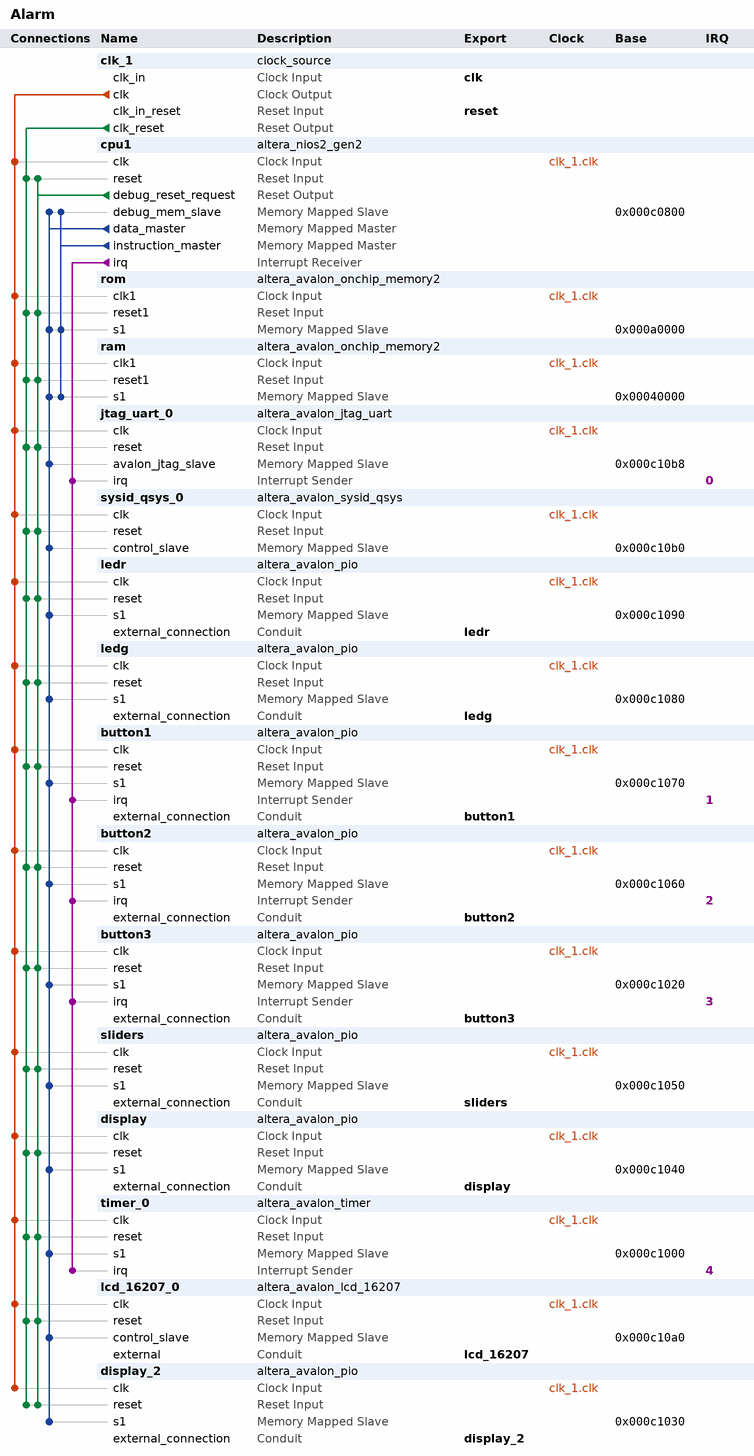
[diagram p0: system contents]
# Platform Designer (Qsys) system Alarm, Cyclone IV E EP4CE115F29C7
# Parameters at their usual value, and those the tool derives, are not listed.
package require -exact qsys 18.1
create_system Alarm
set_project_property DEVICE_FAMILY {Cyclone IV E}
set_project_property DEVICE EP4CE115F29C7

add_instance clk_1 clock_source 18.1
set_instance_parameter_value clk_1 clockFrequency 100000000

add_instance cpu1 altera_nios2_gen2 18.1
set_instance_parameter_value cpu1 dcache_size 2048
set_instance_parameter_value cpu1 exceptionSlave ram.s1
set_instance_parameter_value cpu1 icache_size 4096
set_instance_parameter_value cpu1 impl Tiny
set_instance_parameter_value cpu1 resetSlave rom.s1

add_instance rom altera_avalon_onchip_memory2 18.1
set_instance_parameter_value rom dataWidth 32
set_instance_parameter_value rom dualPort false
set_instance_parameter_value rom initMemContent true
set_instance_parameter_value rom initializationFileName onchip_mem.hex
set_instance_parameter_value rom memorySize 102400
set_instance_parameter_value rom writable false

add_instance ram altera_avalon_onchip_memory2 18.1
set_instance_parameter_value ram dataWidth 32
set_instance_parameter_value ram dualPort false
set_instance_parameter_value ram initMemContent true
set_instance_parameter_value ram initializationFileName onchip_mem.hex
set_instance_parameter_value ram memorySize 204800

add_instance jtag_uart_0 altera_avalon_jtag_uart 18.1
set_instance_parameter_value jtag_uart_0 simInteractiveOptions NO_INTERACTIVE_WINDOWS

add_instance sysid_qsys_0 altera_avalon_sysid_qsys 18.1
set_instance_parameter_value sysid_qsys_0 id 0

add_instance ledr altera_avalon_pio 18.1
set_instance_parameter_value ledr direction Output
set_instance_parameter_value ledr width 2

add_instance ledg altera_avalon_pio 18.1
set_instance_parameter_value ledg direction Output
set_instance_parameter_value ledg width 1

add_instance button1 altera_avalon_pio 18.1
set_instance_parameter_value button1 bitClearingEdgeCapReg true
set_instance_parameter_value button1 captureEdge true
set_instance_parameter_value button1 direction Input
set_instance_parameter_value button1 generateIRQ true
set_instance_parameter_value button1 irqType EDGE
set_instance_parameter_value button1 width 1

add_instance button2 altera_avalon_pio 18.1
set_instance_parameter_value button2 bitClearingEdgeCapReg true
set_instance_parameter_value button2 captureEdge true
set_instance_parameter_value button2 direction Input
set_instance_parameter_value button2 generateIRQ true
set_instance_parameter_value button2 irqType EDGE
set_instance_parameter_value button2 width 1

add_instance button3 altera_avalon_pio 18.1
set_instance_parameter_value button3 bitClearingEdgeCapReg true
set_instance_parameter_value button3 captureEdge true
set_instance_parameter_value button3 direction Input
set_instance_parameter_value button3 generateIRQ true
set_instance_parameter_value button3 irqType EDGE
set_instance_parameter_value button3 width 1

add_instance sliders altera_avalon_pio 18.1
set_instance_parameter_value sliders direction Input
set_instance_parameter_value sliders width 4

add_instance display altera_avalon_pio 18.1
set_instance_parameter_value display direction Output
set_instance_parameter_value display width 32

add_instance timer_0 altera_avalon_timer 18.1
set_instance_parameter_value timer_0 period 1
set_instance_parameter_value timer_0 periodUnits MSEC

add_instance lcd_16207_0 altera_avalon_lcd_16207 18.1

add_instance display_2 altera_avalon_pio 18.1
set_instance_parameter_value display_2 direction Output
set_instance_parameter_value display_2 width 16

# connections
add_connection clk_1.clk button1.clk clock
add_connection clk_1.clk button2.clk clock
add_connection clk_1.clk button3.clk clock
add_connection clk_1.clk cpu1.clk clock
add_connection clk_1.clk display.clk clock
add_connection clk_1.clk display_2.clk clock
add_connection clk_1.clk jtag_uart_0.clk clock
add_connection clk_1.clk lcd_16207_0.clk clock
add_connection clk_1.clk ledg.clk clock
add_connection clk_1.clk ledr.clk clock
add_connection clk_1.clk ram.clk1 clock
add_connection clk_1.clk rom.clk1 clock
add_connection clk_1.clk sliders.clk clock
add_connection clk_1.clk sysid_qsys_0.clk clock
add_connection clk_1.clk timer_0.clk clock
add_connection clk_1.clk_reset button1.reset reset
add_connection clk_1.clk_reset button2.reset reset
add_connection clk_1.clk_reset button3.reset reset
add_connection clk_1.clk_reset cpu1.reset reset
add_connection clk_1.clk_reset display.reset reset
add_connection clk_1.clk_reset display_2.reset reset
add_connection clk_1.clk_reset jtag_uart_0.reset reset
add_connection clk_1.clk_reset lcd_16207_0.reset reset
add_connection clk_1.clk_reset ledg.reset reset
add_connection clk_1.clk_reset ledr.reset reset
add_connection clk_1.clk_reset ram.reset1 reset
add_connection clk_1.clk_reset rom.reset1 reset
add_connection clk_1.clk_reset sliders.reset reset
add_connection clk_1.clk_reset sysid_qsys_0.reset reset
add_connection clk_1.clk_reset timer_0.reset reset
add_connection cpu1.debug_reset_request button1.reset reset
add_connection cpu1.debug_reset_request button2.reset reset
add_connection cpu1.debug_reset_request button3.reset reset
add_connection cpu1.debug_reset_request cpu1.reset reset
add_connection cpu1.debug_reset_request display.reset reset
add_connection cpu1.debug_reset_request display_2.reset reset
add_connection cpu1.debug_reset_request jtag_uart_0.reset reset
add_connection cpu1.debug_reset_request lcd_16207_0.reset reset
add_connection cpu1.debug_reset_request ledg.reset reset
add_connection cpu1.debug_reset_request ledr.reset reset
add_connection cpu1.debug_reset_request ram.reset1 reset
add_connection cpu1.debug_reset_request rom.reset1 reset
add_connection cpu1.debug_reset_request sliders.reset reset
add_connection cpu1.debug_reset_request sysid_qsys_0.reset reset
add_connection cpu1.debug_reset_request timer_0.reset reset
add_connection cpu1.data_master button1.s1 avalon
set_connection_parameter_value cpu1.data_master/button1.s1 baseAddress 0x000c1070
add_connection cpu1.data_master button2.s1 avalon
set_connection_parameter_value cpu1.data_master/button2.s1 baseAddress 0x000c1060
add_connection cpu1.data_master button3.s1 avalon
set_connection_parameter_value cpu1.data_master/button3.s1 baseAddress 0x000c1020
add_connection cpu1.data_master cpu1.debug_mem_slave avalon
set_connection_parameter_value cpu1.data_master/cpu1.debug_mem_slave baseAddress 0x000c0800
add_connection cpu1.data_master display.s1 avalon
set_connection_parameter_value cpu1.data_master/display.s1 baseAddress 0x000c1040
add_connection cpu1.data_master display_2.s1 avalon
set_connection_parameter_value cpu1.data_master/display_2.s1 baseAddress 0x000c1030
add_connection cpu1.data_master jtag_uart_0.avalon_jtag_slave avalon
set_connection_parameter_value cpu1.data_master/jtag_uart_0.avalon_jtag_slave baseAddress 0x000c10b8
add_connection cpu1.data_master lcd_16207_0.control_slave avalon
set_connection_parameter_value cpu1.data_master/lcd_16207_0.control_slave baseAddress 0x000c10a0
add_connection cpu1.data_master ledg.s1 avalon
set_connection_parameter_value cpu1.data_master/ledg.s1 baseAddress 0x000c1080
add_connection cpu1.data_master ledr.s1 avalon
set_connection_parameter_value cpu1.data_master/ledr.s1 baseAddress 0x000c1090
add_connection cpu1.data_master ram.s1 avalon
set_connection_parameter_value cpu1.data_master/ram.s1 baseAddress 0x00040000
add_connection cpu1.data_master rom.s1 avalon
set_connection_parameter_value cpu1.data_master/rom.s1 baseAddress 0x000a0000
add_connection cpu1.data_master sliders.s1 avalon
set_connection_parameter_value cpu1.data_master/sliders.s1 baseAddress 0x000c1050
add_connection cpu1.data_master sysid_qsys_0.control_slave avalon
set_connection_parameter_value cpu1.data_master/sysid_qsys_0.control_slave baseAddress 0x000c10b0
add_connection cpu1.data_master timer_0.s1 avalon
set_connection_parameter_value cpu1.data_master/timer_0.s1 baseAddress 0x000c1000
add_connection cpu1.instruction_master cpu1.debug_mem_slave avalon
set_connection_parameter_value cpu1.instruction_master/cpu1.debug_mem_slave baseAddress 0x000c0800
add_connection cpu1.instruction_master ram.s1 avalon
set_connection_parameter_value cpu1.instruction_master/ram.s1 baseAddress 0x00040000
add_connection cpu1.instruction_master rom.s1 avalon
set_connection_parameter_value cpu1.instruction_master/rom.s1 baseAddress 0x000a0000
add_connection cpu1.irq button1.irq interrupt
set_connection_parameter_value cpu1.irq/button1.irq irqNumber 1
add_connection cpu1.irq button2.irq interrupt
set_connection_parameter_value cpu1.irq/button2.irq irqNumber 2
add_connection cpu1.irq button3.irq interrupt
set_connection_parameter_value cpu1.irq/button3.irq irqNumber 3
add_connection cpu1.irq jtag_uart_0.irq interrupt
set_connection_parameter_value cpu1.irq/jtag_uart_0.irq irqNumber 0
add_connection cpu1.irq timer_0.irq interrupt
set_connection_parameter_value cpu1.irq/timer_0.irq irqNumber 4

# exported interfaces
add_interface button1 conduit end
set_interface_property button1 EXPORT_OF button1.external_connection
add_interface button2 conduit end
set_interface_property button2 EXPORT_OF button2.external_connection
add_interface button3 conduit end
set_interface_property button3 EXPORT_OF button3.external_connection
add_interface clk clock sink
set_interface_property clk EXPORT_OF clk_1.clk_in
add_interface display conduit end
set_interface_property display EXPORT_OF display.external_connection
add_interface display_2 conduit end
set_interface_property display_2 EXPORT_OF display_2.external_connection
add_interface lcd_16207 conduit end
set_interface_property lcd_16207 EXPORT_OF lcd_16207_0.external
add_interface ledg conduit end
set_interface_property ledg EXPORT_OF ledg.external_connection
add_interface ledr conduit end
set_interface_property ledr EXPORT_OF ledr.external_connection
add_interface reset reset sink
set_interface_property reset EXPORT_OF clk_1.clk_in_reset
add_interface sliders conduit end
set_interface_property sliders EXPORT_OF sliders.external_connection

set_interconnect_requirement {$system} qsys_mm.clockCrossingAdapter HANDSHAKE
set_interconnect_requirement {$system} qsys_mm.enableEccProtection FALSE
set_interconnect_requirement {$system} qsys_mm.insertDefaultSlave FALSE
set_interconnect_requirement {$system} qsys_mm.maxAdditionalLatency 1

save_system Alarm.qsys
